# EAGLE design motor_shield_A (EAGLE 6.2)
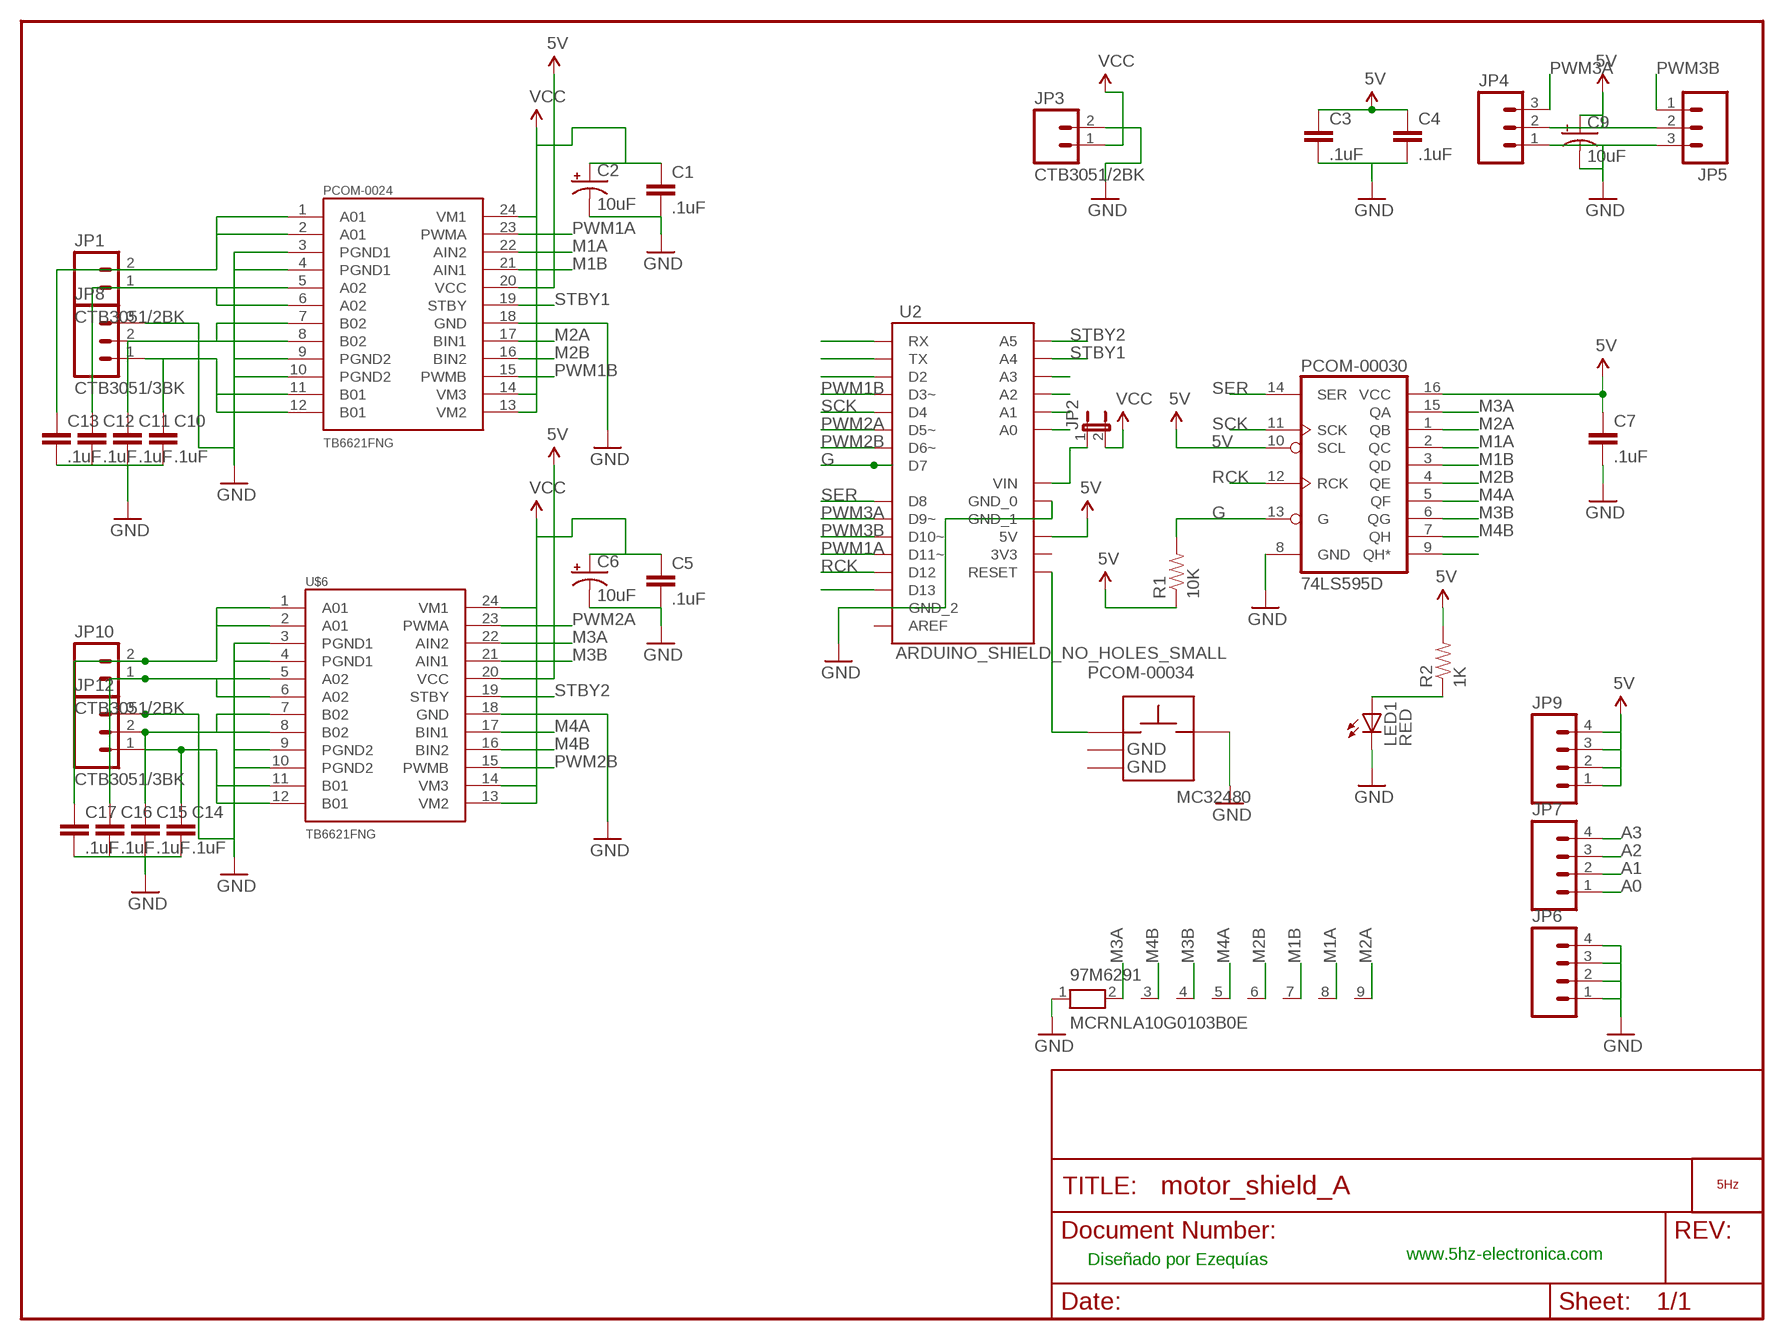
[diagram p0: schematic, sheet 1]

## Parts
97M6291  MCRNLA10G0103B0E  RN08  [RN-9]
C1  .1uF  CAP0603-CAP  [0603-CAP]
C2  10uF  CAP_POL3528-KIT  [EIA3528-KIT]
C3  .1uF  CAP0603-CAP  [0603-CAP]
C4  .1uF  CAP0603-CAP  [0603-CAP]
C5  .1uF  CAP0603-CAP  [0603-CAP]
C6  10uF  CAP_POL3528-KIT  [EIA3528-KIT]
C7  .1uF  CAP0603-CAP  [0603-CAP]
C9  10uF  CAP_POL1206  [EIA3216]
C10  .1uF  CAP0603-CAP  [0603-CAP]
C11  .1uF  CAP0603-CAP  [0603-CAP]
C12  .1uF  CAP0603-CAP  [0603-CAP]
C13  .1uF  CAP0603-CAP  [0603-CAP]
C14  .1uF  CAP0603-CAP  [0603-CAP]
C15  .1uF  CAP0603-CAP  [0603-CAP]
C16  .1uF  CAP0603-CAP  [0603-CAP]
C17  .1uF  CAP0603-CAP  [0603-CAP]
JP1  CTB3051/2BK  M023.5MM  [SCREWTERMINAL-3.5MM-2]
JP2  JUMPER-2PTH  [1X02]
JP3  CTB3051/2BK  M023.5MM  [SCREWTERMINAL-3.5MM-2]
JP4  M03PTH  [1X03]
JP5  M03PTH  [1X03]
JP6  M04PTH  [1X04]
JP7  M04PTH  [1X04]
JP8  CTB3051/3BK  M03SCREW  [SCREWTERMINAL-3.5MM-3]
JP9  M04PTH  [1X04]
JP10  CTB3051/2BK  M023.5MM  [SCREWTERMINAL-3.5MM-2]
JP12  CTB3051/3BK  M03SCREW  [SCREWTERMINAL-3.5MM-3]
LED1  RED  LED0603  [LED-0603]
LOGO1  LOGO_5HZ_H_COOPER_10MM  [5HZ_LOGO_H_COOPER_10MM]
PCOM-0024  TB6621FNG  [SSOP24]
PCOM-00030  74LS595D  [SO16]
PCOM-00034  MC32480  TACTILE_SWITCH_MC32480  [MC32840]
R1  10K  RESISTOR0603-RES  [0603-RES]
R2  1K  RESISTOR0603-RES  [0603-RES]
U2  ARDUINO_SHIELD_NO_HOLES_SMALL  [UNO_SHIELD_SMALL_NO_HOLES]
U$6  TB6621FNG  [SSOP24]

## Nets
5V: C3.1 C4.1 C7.1 C9.A(+) JP4.2 JP5.2 JP9.1 JP9.2 JP9.3 JP9.4 PCOM-0024.20(VCC) PCOM-00030.10(SCL) PCOM-00030.16(VCC) R1.1 R2.2 U2.5V U$6.20(VCC)
A0: JP7.1 U2.A0
A1: JP7.2 U2.A1
A2: JP7.3 U2.A2
A3: JP7.4 U2.A3
G: PCOM-00030.13(G) R1.2 U2.D7
GND: 97M6291.1 C1.2 C2.C(-) C3.2 C4.2 C5.2 C6.C(-) C7.2 C9.C(-) C10.2 C11.2 C12.2 C13.2 C14.2 C15.2 C16.2 C17.2 JP3.2 JP4.1 JP5.3 JP6.1 JP6.2 JP6.3 JP6.4 JP8.3 JP12.3 LED1.C PCOM-0024.3(PGND1) PCOM-0024.4(PGND1) PCOM-0024.9(PGND2) PCOM-0024.10(PGND2) PCOM-0024.18(GND) PCOM-00030.8(GND) PCOM-00034.B U2.GND_0 U2.GND_1 U2.GND_2 U$6.3(PGND1) U$6.4(PGND1) U$6.9(PGND2) U$6.10(PGND2) U$6.18(GND)
M1A: 97M6291.8 PCOM-0024.22(AIN2) PCOM-00030.2(QC)
M1B: 97M6291.7 PCOM-0024.21(AIN1) PCOM-00030.3(QD)
M2A: 97M6291.9 PCOM-0024.17(BIN1) PCOM-00030.1(QB)
M2B: 97M6291.6 PCOM-0024.16(BIN2) PCOM-00030.4(QE)
M3A: 97M6291.2 PCOM-00030.15(QA) U$6.22(AIN2)
M3B: 97M6291.4 PCOM-00030.6(QG) U$6.21(AIN1)
M4A: 97M6291.5 PCOM-00030.5(QF) U$6.17(BIN1)
M4B: 97M6291.3 PCOM-00030.7(QH) U$6.16(BIN2)
N$2: C13.1 JP1.2 PCOM-0024.1(A01) PCOM-0024.2(A01)
N$4: C15.1 JP12.2 U$6.7(B02) U$6.8(B02)
N$5: C12.1 JP1.1 PCOM-0024.5(A02) PCOM-0024.6(A02)
N$6: C14.1 JP12.1 U$6.11(B01) U$6.12(B01)
N$7: C11.1 JP8.2 PCOM-0024.7(B02) PCOM-0024.8(B02)
N$8: JP2.1 U2.VIN
N$9: U2.RX
N$10: U2.TX
N$11: C10.1 JP8.1 PCOM-0024.11(B01) PCOM-0024.12(B01)
N$12: U2.D2
N$13: PCOM-00034.A@1(A) U2.RES(RESET)
N$14: LED1.A R2.1
N$19: C17.1 JP10.2 U$6.1(A01) U$6.2(A01)
N$20: C16.1 JP10.1 U$6.5(A02) U$6.6(A02)
N$23: U2.D13
N$29: PCOM-00030.9(QH*)
PWM1A: PCOM-0024.23(PWMA) U2.D11(D11~)
PWM1B: PCOM-0024.15(PWMB) U2.D3(D3~)
PWM2A: U2.D5(D5~) U$6.23(PWMA)
PWM2B: U2.D6(D6~) U$6.15(PWMB)
PWM3A: JP4.3 U2.D9(D9~)
PWM3B: JP5.1 U2.D10(D10~)
RCK: PCOM-00030.12(RCK) U2.D12
SCK: PCOM-00030.11(SCK) U2.D4
SER: PCOM-00030.14(SER) U2.D8
STBY1: PCOM-0024.19(STBY) U2.A4
STBY2: U2.A5 U$6.19(STBY)
VCC: C1.1 C2.A(+) C5.1 C6.A(+) JP2.2 JP3.1 PCOM-0024.13(VM2) PCOM-0024.14(VM3) PCOM-0024.24(VM1) U$6.13(VM2) U$6.14(VM3) U$6.24(VM1)
Unconnected: PCOM-00034.GND@1(GND) PCOM-00034.GND@2(GND) U2.3.3V(3V3) U2.AREF

## Notes on the sheet
- www.5hz-electronica.com
- Diseñado por Ezequías

## Library data of the parts
97M6291 = resistor-net:RN08: RESISTOR NETWORK; OC_FARNELL: unknown; OC_NEWARK: unknown
C1 C3-C5 C7 C10-C17 = SparkFun:CAP: Capacitor Standard 0603 ceramic capacitor, and 0.1" leaded capacitor.
C2 C6 C9 = SparkFun:CAP_POL: Capacitor Polarized These are standard SMD and PTH capacitors. Normally 10uF, 47uF, and 100uF in electrolytic and tantalum varieties. Always verify the external diameter of the through hole cap, it varies with capacity, voltage, and manufacturer. The EIA devices should be standard.
JP1 JP3 JP10 = SparkFun:M02: Header 2 Standard 2-pin 0.1" header. Use with straight break away headers (SKU : PRT-00116), right angle break away headers (PRT-00553), swiss pins (PRT-00743), machine pins (PRT-00117), and female headers (PRT-00115). Molex polarized connector foot print use with SKU : PRT-08233 with associated crimp pins and housings.
JP2 = SparkFun:JUMPER-2: Jumper Basic 0.1" spaced jumper. Use with breakaway headers.
JP4 JP5 = SparkFun_old:M03: Header 3 Standard 3-pin 0.1" header. Use with straight break away headers (SKU : PRT-00116), right angle break away headers (PRT-00553), swiss pins (PRT-00743), machine pins (PRT-00117), and female headers (PRT-00115). Molex polarized connector foot print use with SKU : PRT-08232 with associated crimp pins and housings.
JP6 JP7 JP9 = SparkFun:M04: Header 4 Standard 4-pin 0.1" header. Use with straight break away headers (SKU : PRT-00116), right angle break away headers (PRT-00553), swiss pins (PRT-00743), machine pins (PRT-00117), and female headers (PRT-00115). Molex polarized connector foot print use with SKU : PRT-08231 with associated crimp pins and housings. 1MM SMD Version SKU: PRT-10208
JP8 JP12 = SparkFun:M03: Header 3 Standard 3-pin 0.1" header. Use with straight break away headers (SKU : PRT-00116), right angle break away headers (PRT-00553), swiss pins (PRT-00743), machine pins (PRT-00117), and female headers (PRT-00115). Molex polarized connector foot print use with SKU : PRT-08232 with associated crimp pins and housings.
LED1 = SparkFun:LED: LEDs Standard schematic elements and footprints for 5mm, 3mm, 1206, and 0603 sized LEDs. 5mm - Spark Fun Electronics SKU : COM-00529 (and others)
LOGO1 = 5hz-electronica:LOGO_5HZ: Logotipo 5Hz "según Pedro"
PCOM-0024 U$6 = SparkFun:TB6621FNG: Toshiba 1A motor driver
PCOM-00030 = SparkFun:74*595: 8-bit SHIFT REGISTER, output latch
PCOM-00034 = PEDRO:TACTILE_SWITCH_MC32480
R1 R2 = SparkFun:RESISTOR: Resistor Basic schematic elements and footprints for 0603, 1206, and PTH resistors.
U2 = PEDRO:ARDUINO_SHIELD

## Board
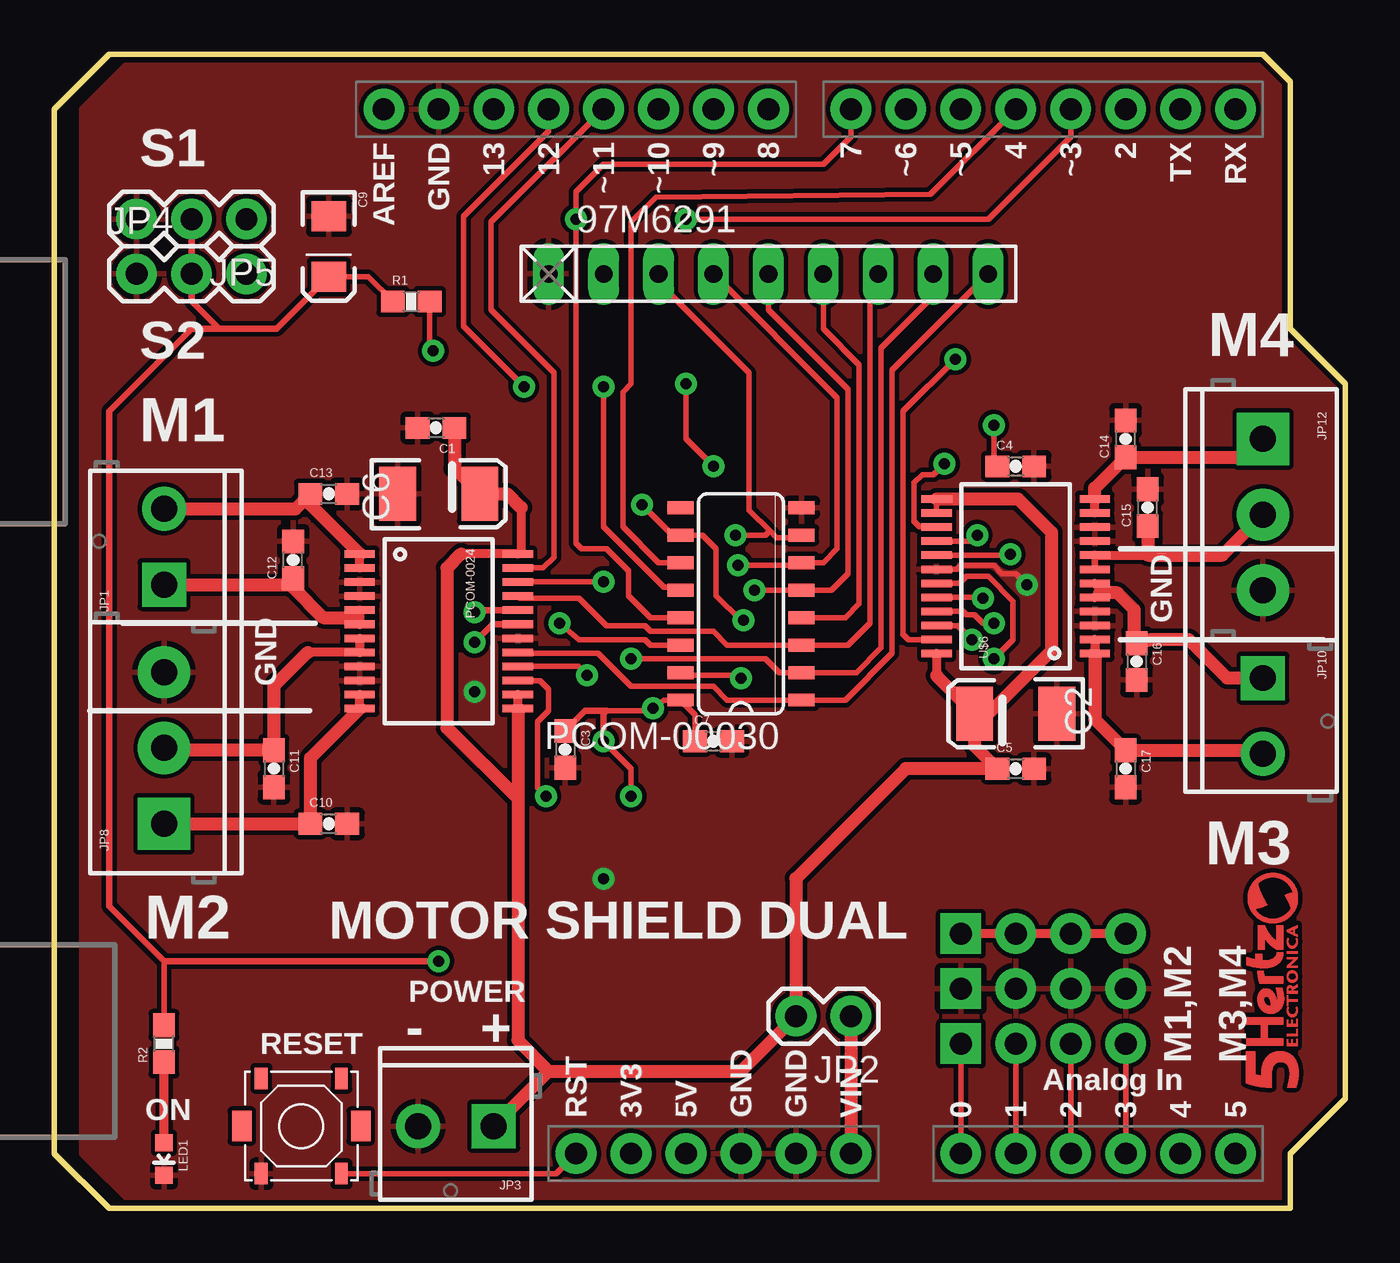
[diagram p1: board, top side]
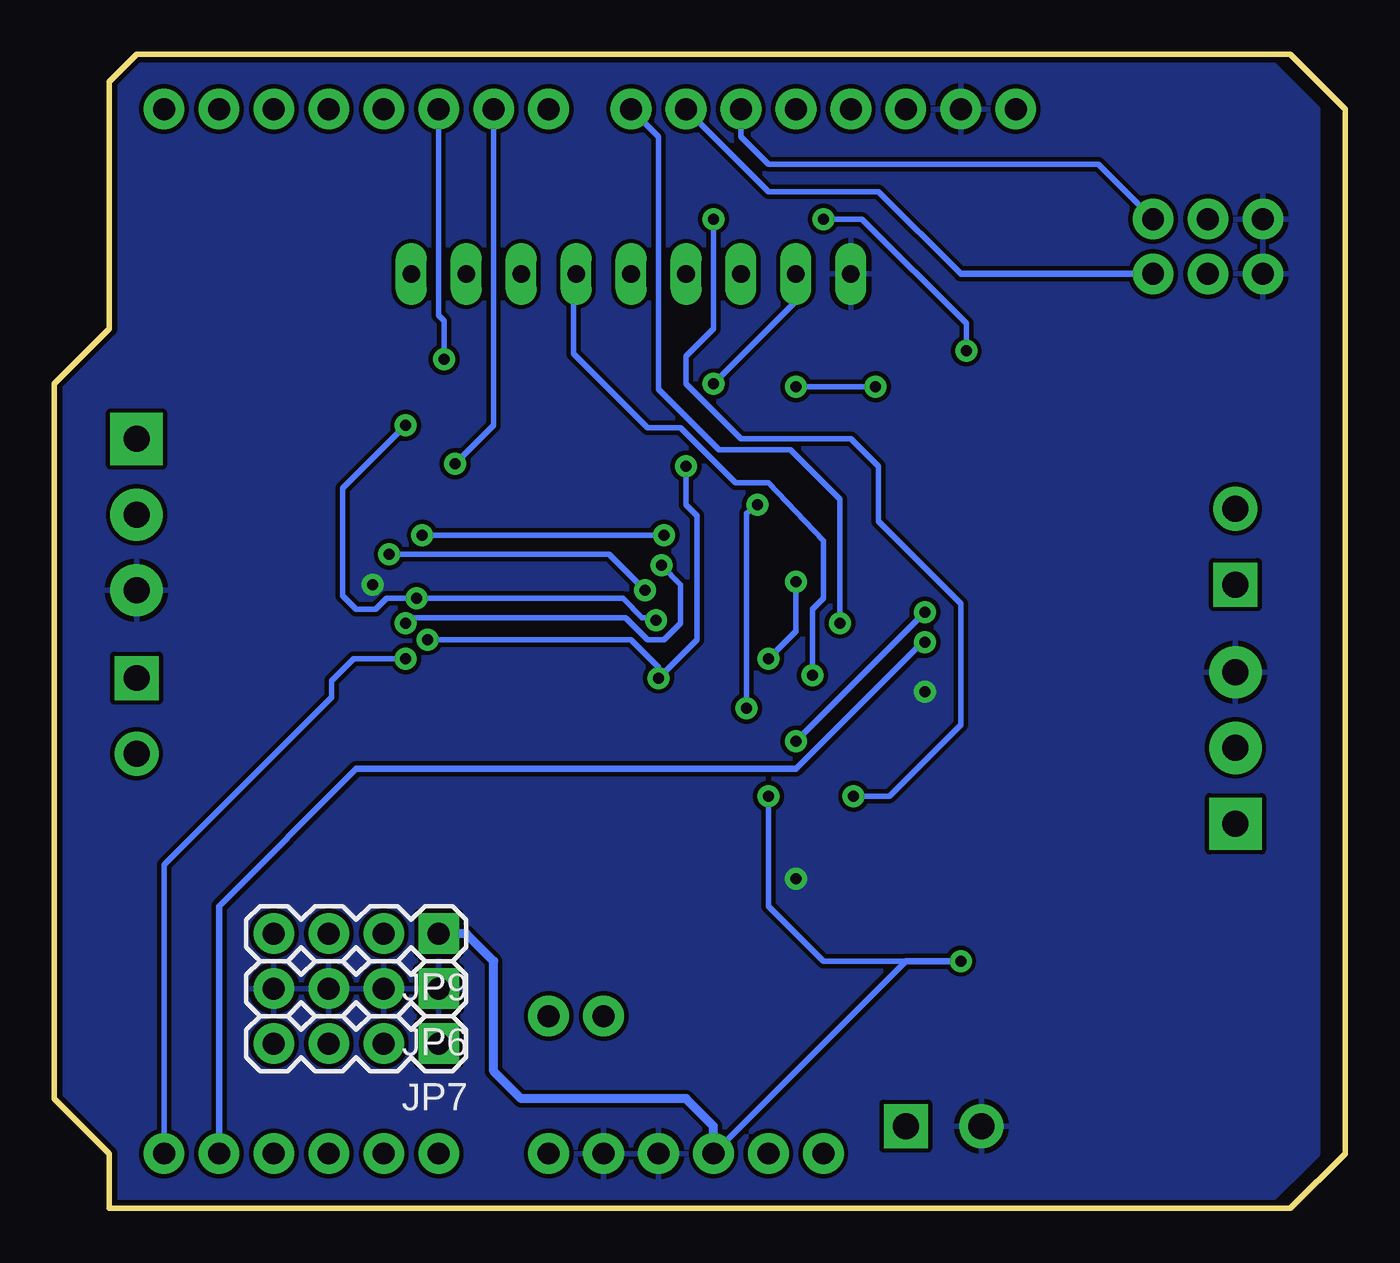
[diagram p2: board, bottom side, seen from below]

Size 59.69 x 53.34 mm. Coordinates in mm from the lower left corner, seen from the top.
Outline: 2.54,53.34 55.88,53.34 57.15,52.07 57.15,40.64 59.69,38.1 59.69,5.08 57.15,2.54 57.15,0 2.54,0 0,2.54 0,50.8 2.54,53.34
Copper layers (1*16): Top 0.035mm / dielectric 1.5mm / Bottom 0.035mm
Design rules: minimum track width 8mil, minimum drill 20mil, track to track 8mil, track to pad 8mil, pad to pad 8mil, via to via 8mil, smd to smd 8mil, copper to edge 10mil, drill to drill 8mil, minimum pad ring 12mil, minimum via ring 10mil, stop-mask expansion 4mil, vias tented up to drill 25mil, thermal gap 10mil

### Footprints (pad centres in the part's own frame; a part is rotated, then mirrored left to right if it is on the bottom)
RN-9 = drill 0.813 long: 1 -10.16,0; 2 -7.62,0; 3 -5.08,0; 4 -2.54,0; 5 0,0; 6 2.54,0; 7 5.08,0; 8 7.62,0; 9 10.16,0
0603-CAP = smd 1.1 x 1: 1 -0.85,0; 2 0.85,0
EIA3528-KIT = smd 1.7 x 2.5: A 1.9,0; C -1.9,0
EIA3216 = smd 1.4 x 1.6: A 1.4,0; C -1.4,0
SCREWTERMINAL-3.5MM-2 = drill 1.2 pad 2.032 square: 1 0,0 | drill 1.2 pad 2.032: 2 3.5,0
1X02 = drill 1.016 pad 1.88: 1 0,0; 2 2.54,0
1X03 = drill 1.016 pad 1.88: 1 0,0; 2 2.54,0; 3 5.08,0
1X04 = drill 1.016 pad 1.88 square: 1 0,0 | drill 1.016 pad 1.88: 2 2.54,0; 3 5.08,0; 4 7.62,0
SCREWTERMINAL-3.5MM-3 = drill 1.2 pad 2.413 square: 1 0,0 | drill 1.2 pad 2.413: 2 3.5,0; 3 7,0
LED-0603 = smd 0.8 x 0.8: A 0,-0.75; C 0,0.75
SSOP24 = smd 0.348 x 1.397: 1 -3.575,-3.656; 2 -2.925,-3.656; 3 -2.275,-3.656; 4 -1.625,-3.656; 5 -0.975,-3.656; 6 -0.325,-3.656; 7 0.325,-3.656; 8 0.975,-3.656; 9 1.625,-3.656; 10 2.275,-3.656; 11 2.925,-3.656; 12 3.575,-3.656; 13 3.575,3.656; 14 2.925,3.656; 15 2.275,3.656; 16 1.625,3.656; 17 0.975,3.656; 18 0.325,3.656; 19 -0.325,3.656; 20 -0.975,3.656; 21 -1.625,3.656; 22 -2.275,3.656; 23 -2.925,3.656; 24 -3.575,3.656
SO16 = smd 0.6 x 1.2: 1 -4.445,-2.8; 2 -3.175,-2.8; 3 -1.905,-2.8; 4 -0.635,-2.8; 5 0.635,-2.8; 6 1.905,-2.8; 7 3.175,-2.8; 8 4.445,-2.8; 9 4.445,2.8; 10 3.175,2.8; 11 1.905,2.8; 12 0.635,2.8; 13 -0.635,2.8; 14 -1.905,2.8; 15 -3.175,2.8; 16 -4.445,2.8
MC32840 = smd 0.6 x 1: A@1 -1.85,2.2; A@2 -1.85,-2.2; B 1.85,2.2; P$5 1.85,-2.2 | smd 0.9 x 1.4: GND@1 -2.75,0; GND@2 2.75,0
0603-RES = smd 1.1 x 1: 1 -0.85,0; 2 0.85,0
UNO_SHIELD_SMALL_NO_HOLES = drill 1.016 pad 1.88: 3.3V 35.56,2.54; 5V 38.1,2.54; A0 50.8,2.54; A1 53.34,2.54; A2 55.88,2.54; A3 58.42,2.54; A4 60.96,2.54; A5 63.5,2.54; AREF 24.13,50.8; D2 58.42,50.8; D3 55.88,50.8; D4 53.34,50.8; D5 50.8,50.8; D6 48.26,50.8; D7 45.72,50.8; D8 41.91,50.8; D9 39.37,50.8; D10 36.83,50.8; D11 34.29,50.8; D12 31.75,50.8; D13 29.21,50.8; GND_0 43.18,2.54; GND_1 40.64,2.54; GND_2 26.67,50.8; RES 33.02,2.54; RX 63.5,50.8; TX 60.96,50.8; VIN 45.72,2.54

### Placement (x,y rotation side)
97M6291  33.02,43.18 0 top
C1  17.65,36.07 180 top
C2  44.45,22.86 180 top
C3  23.62,21.21 270 top
C4  44.45,34.29 0 top
C5  44.45,20.32 0 top
C6  17.78,33.02 0 top
C7  30.48,21.59 0 top
C9  12.7,44.45 270 top
C10  12.7,17.78 0 top
C11  10.16,20.32 270 top
C12  11.05,29.97 90 top
C13  12.7,33.02 0 top
C14  49.53,35.56 90 top
C15  50.55,32.38 90 top
C16  50.04,25.27 270 top
C17  49.53,20.32 270 top
JP1  5.08,28.83 90 top
JP2  36.83,8.89 180 top
JP3  20.32,3.81 180 top
JP4  3.81,43.18 0 top
JP5  8.89,45.72 180 top
JP6  41.91,10.16 180 bottom
JP7  41.91,7.62 180 bottom
JP8  5.08,17.78 90 top
JP9  41.91,12.7 180 bottom
JP10  55.88,24.51 270 top
JP12  55.88,35.56 270 top
LED1  5.08,2.29 180 top
LOGO1  57.53,5.59 90 top
PCOM-0024  17.78,26.67 270 top
PCOM-00030  31.75,27.94 90 top
PCOM-00034  11.43,3.81 180 top
R1  16.51,41.91 0 top
R2  5.08,7.62 90 top
U2  -8.89,0 0 top
U$6  44.45,29.21 90 top

### Tracks (layer width: path | path; a pad name or v marks a point on that pad's centre or on a via)
5V  (via drill 0.51)
  Top 0.254: v31.88,27.18 31.75,27.18 30.61,28.32 30.61,30.48 29.97,31.11 PCOM-00030.10 28.82,31.24 28.45,31.24 v27.18,32.51 | U$6.20 42.5,28.23 v42.93,28.19 | v43.43,36.2 43.43,34.46 C4.1 | 25.53,22.99 27.56,22.99 v27.69,23.11 28.19,23.5 PCOM-00030.16 29.63,22.82 C7.1 | C9.A 14.52,43.05 R1.1 | v26.67,19.05 26.67,20.32 v25.4,21.59 | R2.2 5.08,11.43
  Top 0.305: JP5.2 JP4.2 6.35,41.91 7.62,40.64 | 7.62,40.64 10.29,40.64 C9.A | 7.62,40.64 6.35,40.64 2.54,36.83 2.54,13.97 5.08,11.43 v17.78,11.43 | C3.1 24.55,22.99 25.53,22.99 25.4,22.86 v25.4,21.59 | PCOM-0024.20 19.52,27.64 v19.43,27.56
  Top 0.406: JP9.4 JP9.3 JP9.2 JP9.1
  Bottom 0.254: v43.43,36.2 46.35,33.27 46.35,28.32 45.72,27.69 44.83,27.69 44.32,28.19 v42.93,28.19 33.4,28.19 32.51,27.3 32,27.3 v31.88,27.18 | v27.69,23.11 27.69,32.13 v27.18,32.51 | 20.32,11.43 24.13,11.43 26.67,13.97 v26.67,19.05
  Bottom 0.305: v17.78,11.43 20.32,11.43 U2.5V | v19.43,27.56 v25.4,21.59
  Bottom 0.406: U2.5V 29.21,3.81 30.48,5.08 38.1,5.08 39.37,6.35 39.37,11.43 40.64,12.7 JP9.1
A0
  Top 0.254: JP7.1 U2.A0
A1
  Top 0.254: JP7.2 U2.A1
A2
  Top 0.254: JP7.3 U2.A2
A3
  Top 0.254: JP7.4 U2.A3
G  (via drill 0.51)
  Top 0.254: U2.D7 36.83,49.53 35.56,48.26 25.4,48.26 24.13,46.99 v24.13,45.72 24.13,30.73 24.38,30.48 25.53,30.48 26.54,29.46 26.54,28.32 27.56,27.3 PCOM-00030.13 | R1.2 17.36,39.79 v17.53,39.62
  Bottom 0.254: v17.53,39.62 17.53,40.89 22.35,45.72 v24.13,45.72
GND  (via drill 0.51)
  Top 0.254: U$6.18 41.73,29.54 41.91,29.72 43.43,29.72 43.81,29.34 44.45,29.34 v44.96,28.83
  other vias: 19.43,23.88 25.4,15.24
  pour Bottom: 3.81,53.34 55.88,53.34 57.15,52.07 57.15,40.64 59.69,38.1 59.69,5.08 57.15,2.54 57.15,0 3.81,0 1.27,2.54 1.27,50.8
  pour Top: 1.27,50.8 3.81,53.34 55.88,53.34 57.15,52.07 57.15,40.64 59.69,38.1 59.69,5.08 57.15,2.54 57.15,0 3.81,0 1.27,2.54
M1A  (via drill 0.51)
  Top 0.254: 97M6291.8 40.64,42.16 38.23,39.75 38.23,25.91 37.08,24.77 PCOM-00030.2 33.53,24.77 32.89,25.4 v26.67,25.4 | v25.4,28.96 PCOM-0024.22
  Bottom 0.254: v25.4,28.96 25.4,26.67 v26.67,25.4
M1B
  Top 0.254: 97M6291.7 37.72,42.8 37.72,27.05 36.7,26.04 PCOM-00030.3 31.12,26.04 30.48,26.67 27.56,26.67 27.3,26.92 25.53,26.92 24.26,28.19 21.54,28.19 PCOM-0024.21
M2A
  Top 0.254: 97M6291.9 38.73,38.73 38.73,25.65 36.58,23.5 PCOM-00030.1 31.12,23.5 30.48,24.13 26.67,24.13 25.15,25.65 21.48,25.65 PCOM-0024.17
M2B  (via drill 0.51)
  Top 0.254: PCOM-00030.4 36.58,27.3 37.21,27.94 37.21,38.99 35.56,40.64 97M6291.6 | PCOM-0024.16 24.23,25.05 v24.64,24.64
  Bottom 0.254: v24.64,24.64 24.64,27.69 24.13,28.19 24.13,30.86 26.67,33.53 28.19,33.53 30.73,36.07 32.26,36.07 35.69,39.5 35.69,43.05 97M6291.6
M3A  (via drill 0.51)
  Top 0.254: U$6.22 41.77,26.93 v42.42,26.29 | PCOM-00030.15 29.08,24.64 31.62,24.64 v31.75,24.51 | v29.21,38.1 29.21,35.56 v30.48,34.29
  Bottom 0.254: v42.42,26.29 33.02,26.29 31.75,25.02 v31.75,24.51 29.97,26.29 29.97,32 30.48,32.51 v30.48,34.29 | 97M6291.2 25.4,41.91 v29.21,38.1
M3B  (via drill 0.51)
  Top 0.254: 97M6291.4 36.2,37.47 36.2,30.48 35.56,29.84 PCOM-00030.6 34.42,29.72 v31.62,29.72 | U$6.21 42.01,27.59 42.16,27.43 42.55,27.43 42.93,27.05 v43.43,27.05
  Bottom 0.254: v31.62,29.72 30.73,28.83 30.73,27.05 31.5,26.29 32.26,26.29 33.27,27.3 43.05,27.3 43.31,27.05 v43.43,27.05
M4A  (via drill 0.51)
  Top 0.254: 97M6291.5 33.02,41.53 36.7,37.85 36.7,29.34 35.94,28.57 PCOM-00030.5 v32.38,28.57 | 43.81,30.23 v44.2,30.23 44.16,30.18 U$6.17
  Bottom 0.254: v44.2,30.23 34.04,30.23 v32.38,28.57
M4B  (via drill 0.51)
  Top 0.254: 97M6291.3 27.94,42.8 32.13,38.61 32.13,32.26 33.08,31.3 | 33.08,31.3 33.4,30.99 34.42,30.99 PCOM-00030.7 | U$6.16 42.52,30.84 v42.67,31.11 | v31.5,31.11 32.89,31.11 33.08,31.3
  Bottom 0.254: 42.42,30.86 v42.67,31.11 v31.5,31.11
N$2
  Top 0.406: PCOM-0024.2 PCOM-0024.1
  Top 0.61: JP1.2 11.16,32.33 C13.1 11.85,32.52 PCOM-0024.1
N$4
  Top 0.305: U$6.7 U$6.8
  Top 0.406: U$6.8 50.55,30.18
  Top 0.61: JP12.2 54.01,30.18 50.55,30.18 C15.1
N$5
  Top 0.406: 13.78,27.3 PCOM-0024.5 PCOM-0024.6
  Top 0.61: JP1.1 10.96,28.83 C12.1 11.05,28.7 12.45,27.3 13.78,27.3
N$6
  Top 0.406: U$6.11 U$6.12
  Top 0.61: U$6.12 48.11,33.29 C14.1 55.03,34.71 JP12.1
N$7
  Top 0.406: 11.72,25.7 PCOM-0024.8 PCOM-0024.7
  Top 0.61: 11.72,25.7 10.16,24.13 C11.1 5.19,21.17 JP8.2
N$8
  Top 0.61: JP2.1 U2.VIN
N$11
  Top 0.406: PCOM-0024.12 PCOM-0024.11
  Top 0.61: JP8.1 C10.1 11.85,20.82 PCOM-0024.12
N$13
  Top 0.254: PCOM-00034.A@1 23.2,1.61 U2.RES
N$14
  Top 0.406: LED1.A R2.1
N$19
  Top 0.406: U$6.2 U$6.1
  Top 0.61: U$6.1 48.11,22.59 C17.1 55.34,21.17 JP10.2
N$20
  Top 0.254: 49.91,26.25 C16.1
  Top 0.406: 48.54,28.45 U$6.6 | 48.32,28.45 U$6.5
  Top 0.61: JP10.1 54.23,24.51 52.45,26.29 50.71,26.29 C16.1 | 48.32,28.45 48.54,28.45 49.15,28.45 49.91,27.69 49.91,26.25
PWM1A
  Top 0.254: PCOM-0024.23 22.61,29.59 23.11,30.1 23.11,38.61 20.19,41.53 20.19,45.59 U2.D11
PWM1B  (via drill 0.51)
  Top 0.254: U2.D3 46.99,49.53 43.18,45.72 v29.21,45.72 | PCOM-0024.15 22.47,24.39 22.86,24 22.86,22.99 22.35,22.48 22.35,19.43 v22.73,19.05
  Bottom 0.254: v29.21,45.72 29.21,40.64 30.48,39.37 30.48,38.1 27.94,35.56 22.86,35.56 21.59,34.29 21.59,31.75 17.78,27.94 17.78,22.35 21.08,19.05 v22.73,19.05
PWM2A  (via drill 0.51)
  Top 0.254: U$6.23 40.77,26.29 39.5,26.29 39.24,26.54 39.24,36.83 v41.66,39.24
  Bottom 0.254: v41.66,39.24 41.66,41.02 41.91,41.27 U2.D5
PWM2B  (via drill 0.51)
  Top 0.254: U$6.15 40.78,31.5 40.01,31.5 39.75,31.75 39.75,33.53 40.13,33.91 40.64,33.91 v41.15,34.42
  Bottom 0.254: U2.D6 39.37,36.2 v41.15,34.42
PWM3A
  Bottom 0.254: 17.78,43.18 21.59,46.99 26.67,46.99 U2.D9
  Bottom 0.305: JP4.3 17.78,43.18
PWM3B
  Bottom 0.254: U2.D10 27.94,49.53 26.67,48.26 11.43,48.26 JP5.1
RCK  (via drill 0.51)
  Top 0.254: U2.D12 22.86,49.78 18.92,45.85 18.92,40.77 v21.72,37.97 | v25.4,37.97 25.4,31.5 28.19,28.7 28.82,28.7 PCOM-00030.12
  Bottom 0.254: v21.72,37.97 v25.4,37.97
SCK
  Top 0.254: U2.D4 40.51,46.86 27.81,46.74 26.67,45.59 26.67,38.1 26.29,37.72 26.29,31.5 27.94,29.84 PCOM-00030.11
SER  (via drill 0.51)
  Top 0.254: v23.37,27.05 24.26,26.29 27.3,26.29 27.56,26.04 PCOM-00030.14
  Bottom 0.254: v23.37,27.05 23.37,32.77 25.65,35.05 28.96,35.05 31.75,37.85 31.75,49.53 U2.D8
STBY1  (via drill 0.51)
  Top 0.305: PCOM-0024.19 20.26,27 v19.43,26.16
  Bottom 0.305: v19.43,26.16 19.56,26.16 25.4,20.32 45.72,20.32 52.07,13.97 U2.A4
STBY2  (via drill 0.51)
  Top 0.254: v43.43,25.4 44.32,26.29 44.32,28.07 43.18,29.21 42.16,29.21 41.84,28.89 U$6.19
  Bottom 0.254: v43.43,25.4 45.85,25.4 46.86,24.38 46.86,23.62 54.61,15.88 U2.A5
VCC
  Top 0.254: U$6.14 U$6.13
  Top 0.406: PCOM-0024.13 PCOM-0024.14 | 21.59,32.38 21.59,30.4 PCOM-0024.24 18.81,30.25 | U$6.24 40.79,24.62
  Top 0.61: JP3.1 22.86,6.35 | 22.86,6.35 31.75,6.35 JP2.2 34.29,15.24 39.37,20.32 C5.1 42.55,21.37 C2.A | PCOM-0024.13 21.44,18.92 | 21.44,18.92 21.44,7.77 22.86,6.35 | C1.1 18.5,34.2 C6.A 20.95,33.02 21.59,32.38 | 18.81,30.25 18.16,29.59 18.16,22.2 21.44,18.92 | C2.A 43.18,22.86 46.1,25.78 46.1,31.24 44.56,32.78 U$6.13 | 40.79,24.62 C2.A

### Text on the board
tPlace: S1 | S2 | M4 | M1 | GND | GND | M3 | M2 | MOTOR SHIELD DUAL | POWER | RESET | - | + | M1,M2 | M3,M4 | ON